# EAGLE design SevSeg-Shield-v11 (EAGLE 6.2)
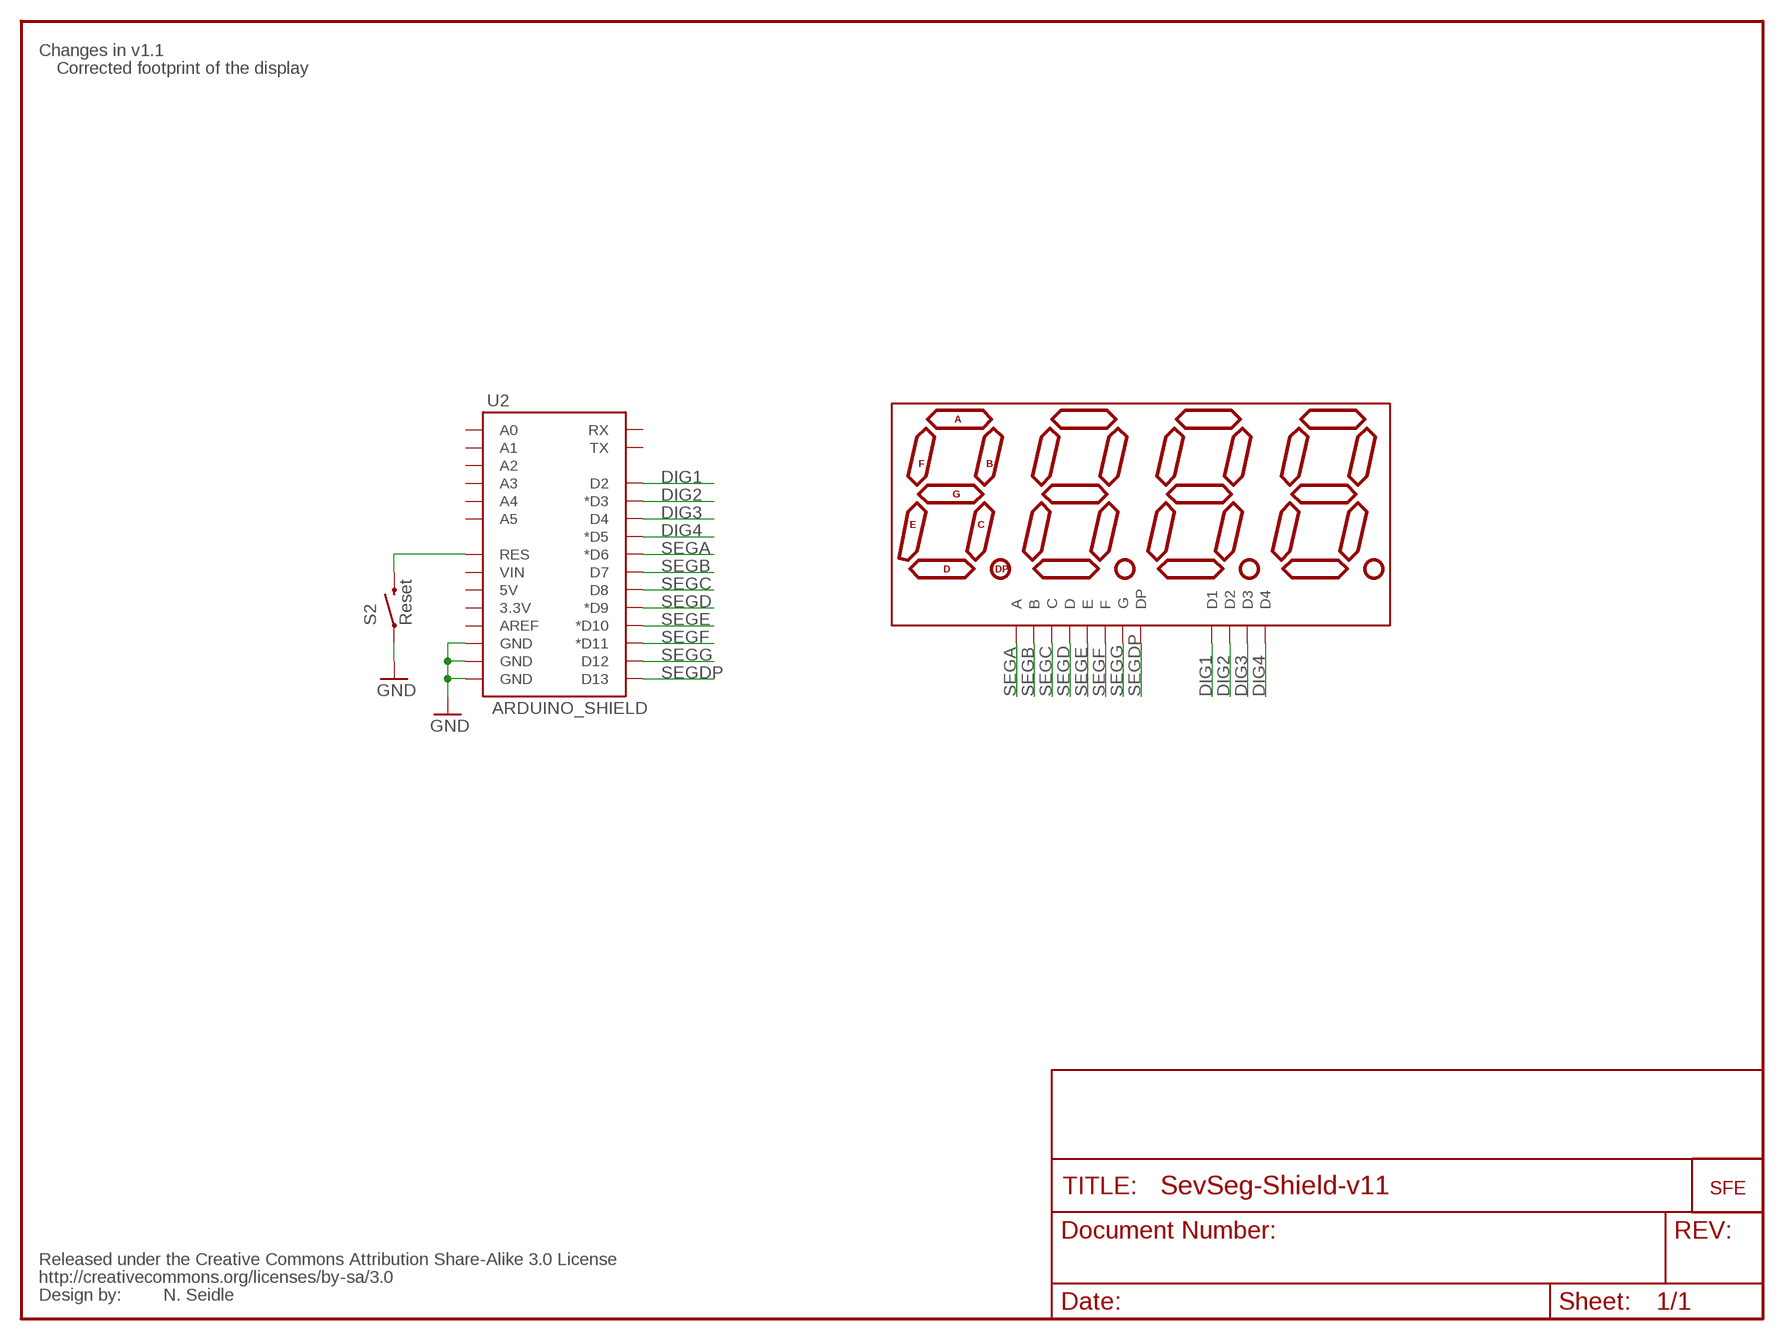
[diagram p0: schematic, sheet 1]

## Parts
S2  Reset  SWITCH-MOMENTARY-2PTH  [TACTILE-PTH]
U2  ARDUINO_SHIELD  ARDUINO_SHIELDLABEL  [DUEMILANOVE_SHIELD]
U$1  7-SEGMENT-4DIGIT-COUNTERPTH  [7-SEGMENT-4DIGIT-COUNTER]
U$3  CREATIVE_COMMONS  [CREATIVE_COMMONS]
U$7  LOGO-SFENEW  [SFE-NEW-WEBLOGO]

## Nets
ARST: S2.3 U2.RES
DIG1: U2.D2 U$1.12(D1)
DIG2: U2.D3(*D3) U$1.9(D2)
DIG3: U2.D4 U$1.8(D3)
DIG4: U2.D5(*D5) U$1.6(D4)
GND: S2.1 U2.GND@0(GND) U2.GND@1(GND) U2.GND@2(GND)
SEGA: U2.D6(*D6) U$1.11(A)
SEGB: U2.D7 U$1.7(B)
SEGC: U2.D8 U$1.4(C)
SEGD: U2.D9(*D9) U$1.2(D)
SEGDP: U2.D13 U$1.3(DP)
SEGE: U2.D10(*D10) U$1.1(E)
SEGF: U2.D11(*D11) U$1.10(F)
SEGG: U2.D12 U$1.5(G)
Unconnected: U2.3.3V U2.5V U2.A0 U2.A1 U2.A2 U2.A3 U2.A4 U2.A5 U2.AREF U2.RX U2.TX U2.VIN

## Notes on the sheet
- Changes in v1.1
- Corrected footprint of the display
- N. Seidle

## Library data of the parts
S2 = SparkFun:SWITCH-MOMENTARY-2
U2 = SparkFun:ARDUINO_SHIELD
U$1 = SparkFun-Displays:7-SEGMENT-4DIGIT-COUNTER
U$3 = SparkFun:CREATIVE_COMMONS
U$7 = SparkFun:LOGO-SFE: Spark Fun Electronics PCB Logo This is the standard Spark Fun Electronics PCB logo.

## Board
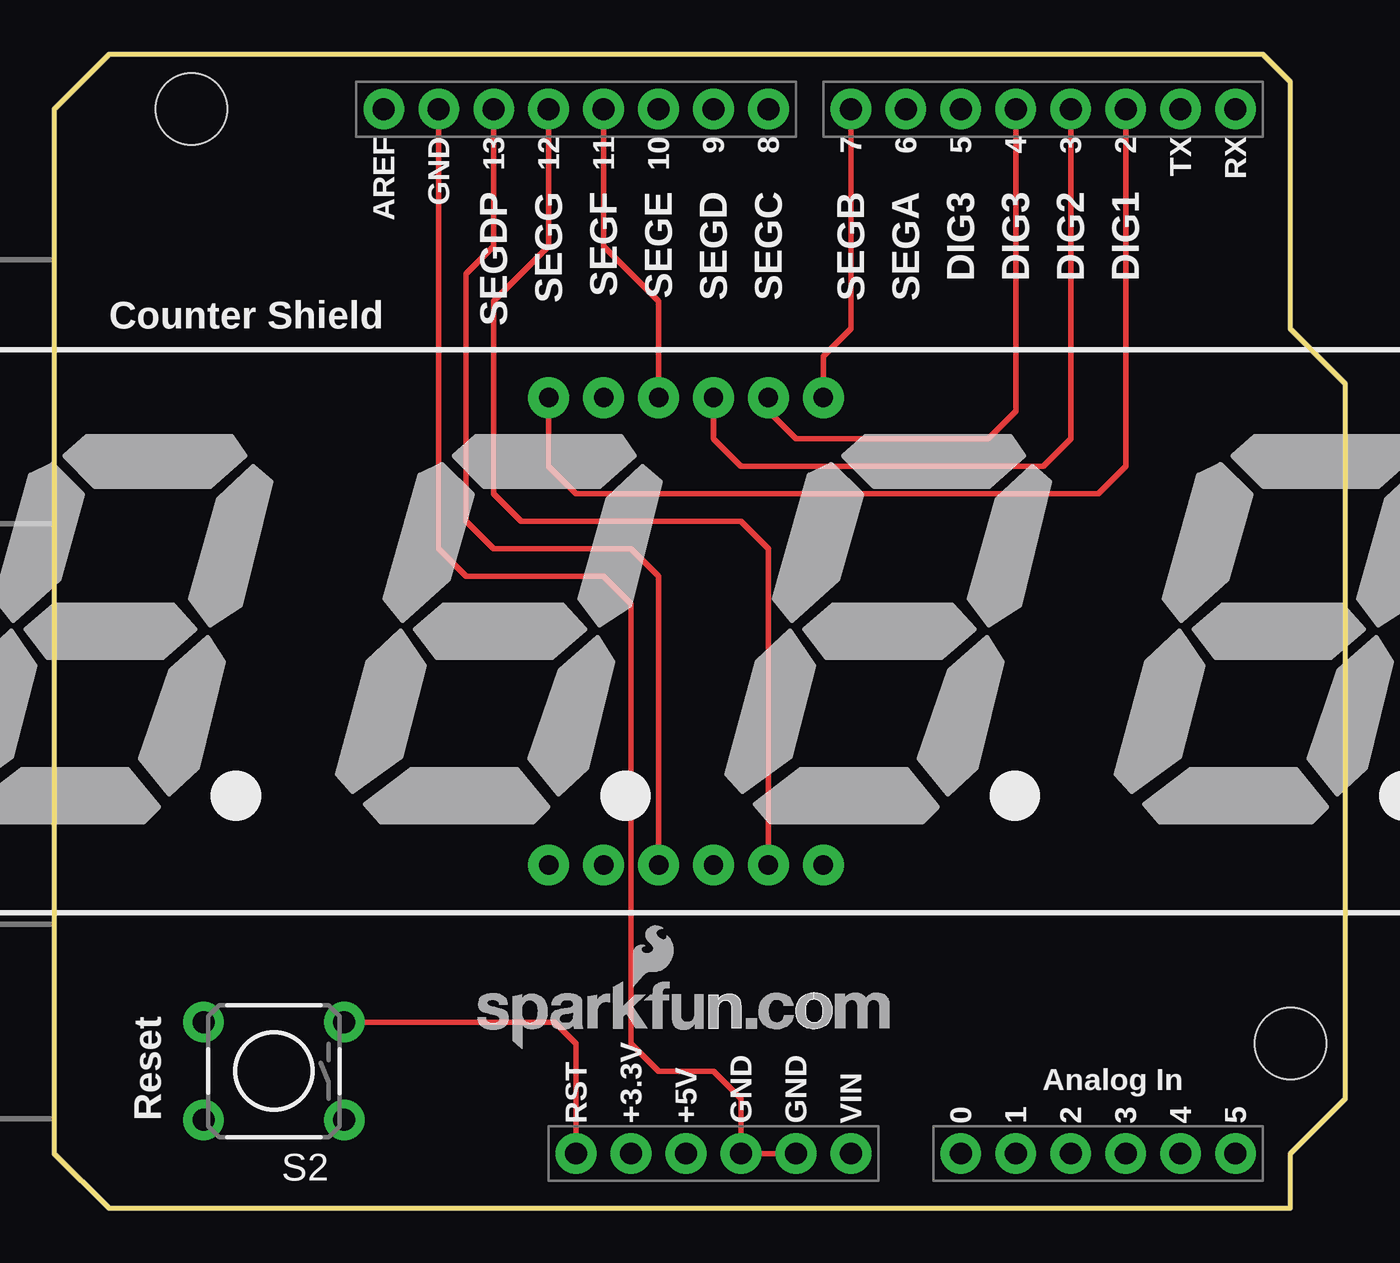
[diagram p1: board, top side]
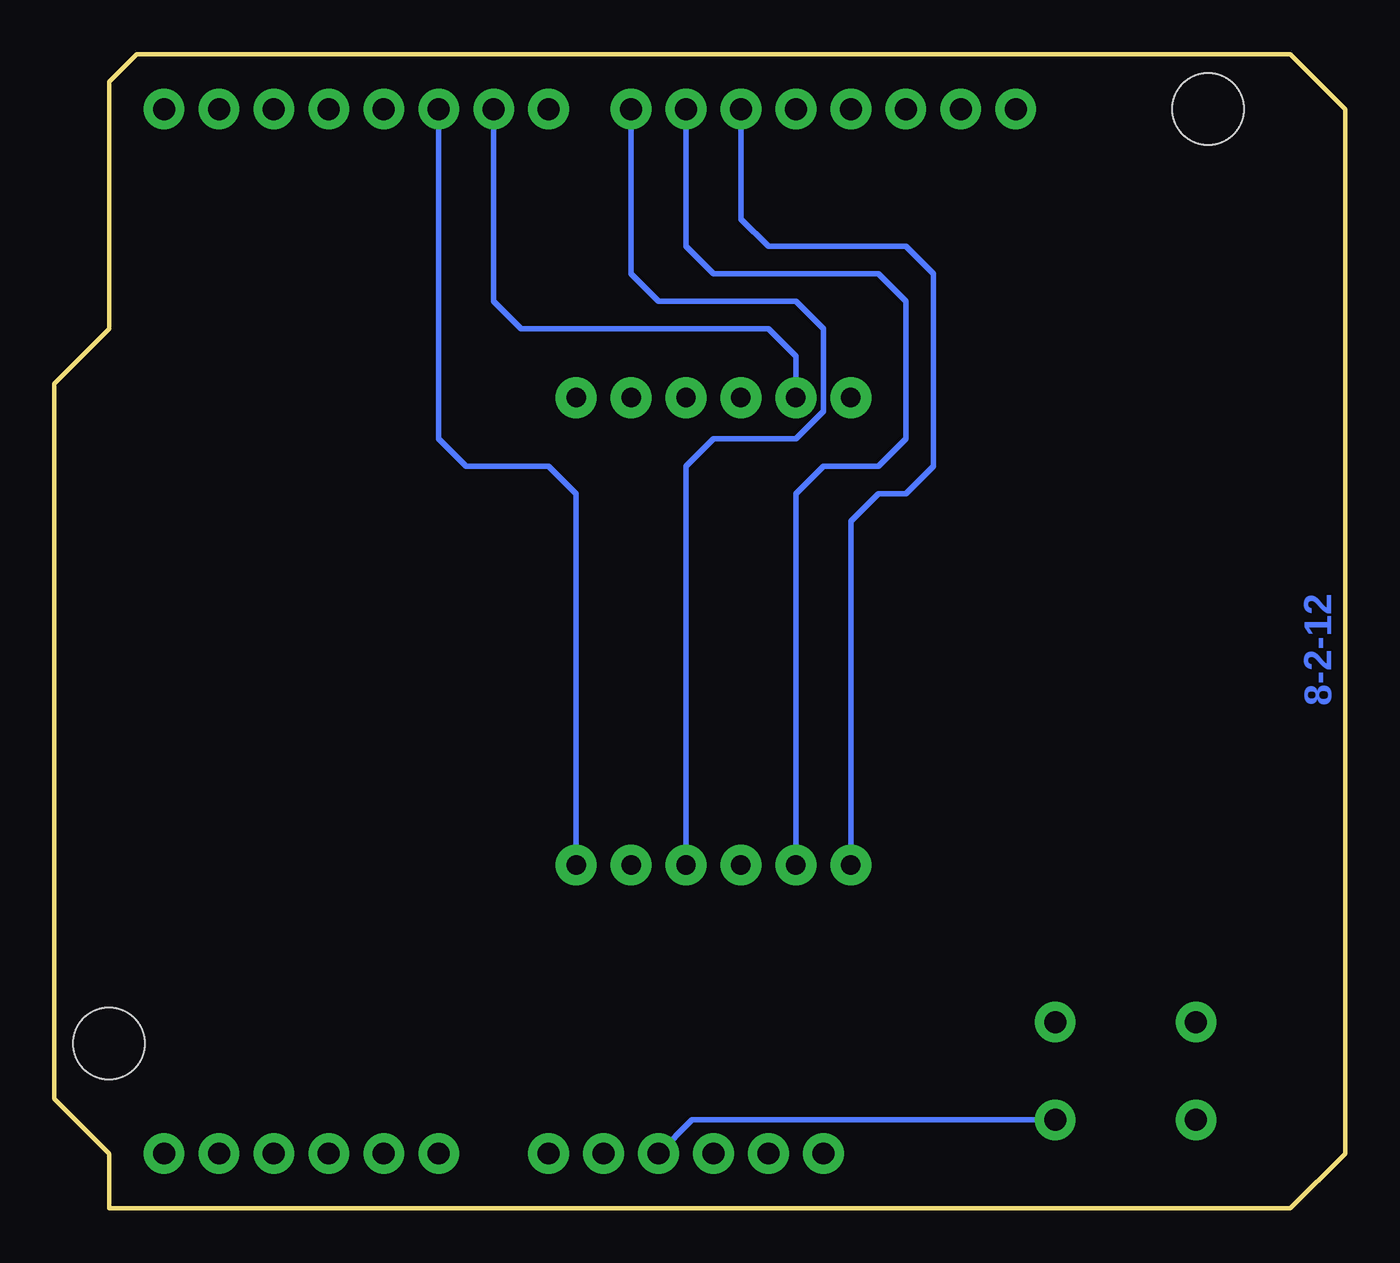
[diagram p2: board, bottom side, seen from below]

Size 59.69 x 53.34 mm. Coordinates in mm from the lower left corner, seen from the top.
Outline: 55.88,53.34 57.15,52.07 57.15,40.64 59.69,38.1 59.69,5.08 57.15,2.54 57.15,0 2.54,0 0,2.54 0,50.8 2.54,53.34 55.88,53.34
Copper layers (1*16): Top 0.035mm / dielectric 1.5mm / Bottom 0.035mm
Design rules: minimum track width 8mil, minimum drill 20mil, track to track 8mil, track to pad 8mil, pad to pad 8mil, via to via 8mil, smd to smd 8mil, copper to edge 10mil, drill to drill 8mil, minimum pad ring 12mil, minimum via ring 10mil, stop-mask expansion 4mil, vias tented up to drill 20mil, thermal gap 10mil

### Footprints (pad centres in the part's own frame; a part is rotated, then mirrored left to right if it is on the bottom)
TACTILE-PTH = drill 1.016 pad 1.88: 1 -3.251,2.261; 2 3.251,2.261; 3 -3.251,-2.261; 4 3.251,-2.261
DUEMILANOVE_SHIELD = drill 1.016 pad 1.88: 3.3V 50.8,26.67; 5V 50.8,29.21; A0 50.8,41.91; A1 50.8,44.45; A2 50.8,46.99; A3 50.8,49.53; A4 50.8,52.07; A5 50.8,54.61; AREF 2.54,15.24; D2 2.54,49.53; D3 2.54,46.99; D4 2.54,44.45; D5 2.54,41.91; D6 2.54,39.37; D7 2.54,36.83; D8 2.54,33.02; D9 2.54,30.48; D10 2.54,27.94; D11 2.54,25.4; D12 2.54,22.86; D13 2.54,20.32; GND@0 50.8,31.75; GND@1 50.8,34.29; GND@2 2.54,17.78; RES 50.8,24.13; RX 2.54,54.61; TX 2.54,52.07; VIN 50.8,36.83 | hole 3.302: 45.72,57.15; 2.54,6.35
7-SEGMENT-4DIGIT-COUNTER = drill 0.9 pad 1.88: 1 -6.35,-10.795; 2 -3.81,-10.795; 3 -1.27,-10.795; 4 1.27,-10.795; 5 3.81,-10.795; 6 6.35,-10.795; 7 6.35,10.795; 8 3.81,10.795; 9 1.27,10.795; 10 -1.27,10.795; 11 -3.81,10.795; 12 -6.35,10.795

### Placement (x,y rotation side)
S2  10.16,6.35 180 top
U2  0,53.34 270 top
U$1  29.21,26.67 0 top
U$3  -19.05,-11.43 0 top  (outside the outline)
U$7  19.56,7.37 0 top

### Tracks (layer width: path | path; a pad name or v marks a point on that pad's centre or on a via)
ARST
  Top 0.254: S2.3 23.14,8.61 24.13,7.62 U2.RES
DIG1
  Top 0.254: U2.D2 49.53,34.29 48.26,33.02 24.13,33.02 22.86,34.29 U$1.12
DIG2
  Top 0.254: U$1.9 30.48,35.56 31.75,34.29 45.72,34.29 46.99,35.56 U2.D3
DIG3
  Top 0.254: U$1.8 33.02,36.83 34.29,35.56 43.18,35.56 44.45,36.83 U2.D4
DIG4
  Bottom 0.254: U$1.6 35.56,33.02 36.83,34.29 40.64,34.29 41.91,35.56 U2.D5
GND
  Top 0.254: U2.GND@2 17.78,30.48 19.05,29.21 25.4,29.21 26.67,27.94 26.67,7.62 27.94,6.35 30.48,6.35 31.75,5.08 U2.GND@0 U2.GND@1
  Bottom 0.254: S2.1 30.2,4.09 U2.GND@0
SEGA
  Bottom 0.254: U$1.11 25.4,39.37 26.67,40.64 38.1,40.64 39.37,41.91 U2.D6
SEGB
  Top 0.254: U$1.7 35.56,39.37 36.83,40.64 U2.D7
SEGC
  Bottom 0.254: U$1.4 30.48,34.29 29.21,35.56 25.4,35.56 24.13,36.83 24.13,40.64 25.4,41.91 31.75,41.91 33.02,43.18 U2.D8
SEGD
  Bottom 0.254: U$1.2 25.4,33.02 24.13,34.29 21.59,34.29 20.32,35.56 20.32,41.91 21.59,43.18 29.21,43.18 30.48,44.45 U2.D9
SEGDP
  Top 0.254: U$1.3 27.94,29.21 26.67,30.48 20.32,30.48 19.05,31.75 19.05,43.18 20.32,44.45 U2.D13
SEGE
  Bottom 0.254: U$1.1 22.86,31.75 21.59,33.02 20.32,33.02 19.05,34.29 19.05,43.18 20.32,44.45 26.67,44.45 27.94,45.72 U2.D10
SEGF
  Top 0.254: U$1.10 27.94,41.91 25.4,44.45 U2.D11
SEGG
  Top 0.254: U$1.5 33.02,30.48 31.75,31.75 21.59,31.75 20.32,33.02 20.32,41.91 22.86,44.45 U2.D12

### Text on the board
Bottom: 8-2-12
tPlace: SEGDP | SEGG | SEGF | SEGE | SEGD | SEGC | SEGB | SEGA | DIG3 | DIG3 | DIG2 | DIG1 | Counter Shield | Reset | N. Seidle